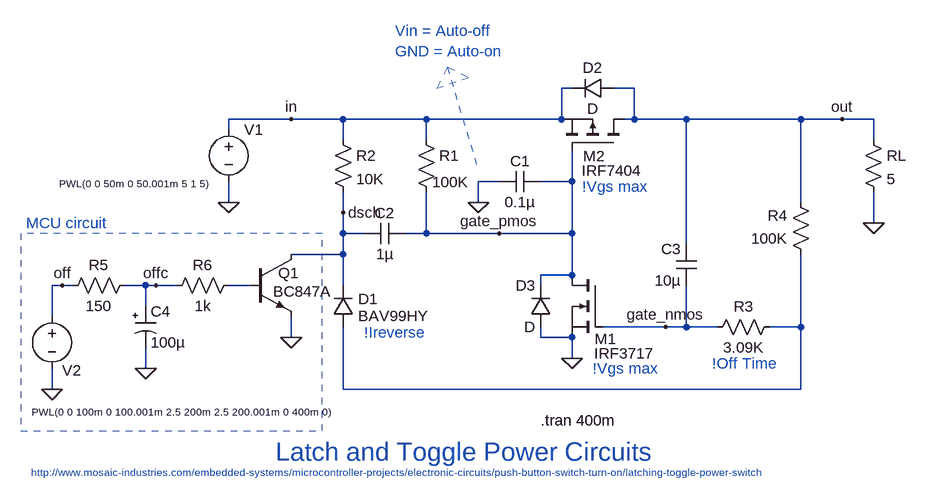
[diagram p0: schematic 01-analog_latch_npmos.asc]
01-analog_latch_npmos.asc, the LTspice schematic file:
Version 4
SHEET 1 1268 680
WIRE 240 -160 224 -160
WIRE 336 -160 304 -160
WIRE -192 -112 -288 -112
WIRE -112 -112 -192 -112
WIRE 16 -112 -112 -112
WIRE 224 -112 224 -160
WIRE 224 -112 16 -112
WIRE 336 -112 336 -160
WIRE 336 -112 320 -112
WIRE 416 -112 336 -112
WIRE 592 -112 416 -112
WIRE 656 -112 592 -112
WIRE 704 -112 656 -112
WIRE -288 -96 -288 -112
WIRE -112 -80 -112 -112
WIRE 16 -80 16 -112
WIRE 704 -80 704 -112
WIRE 128 -16 96 -16
WIRE 240 -16 240 -64
WIRE 240 -16 192 -16
WIRE -288 16 -288 -16
WIRE 96 16 96 -16
WIRE 592 16 592 -112
WIRE -112 32 -112 0
WIRE 704 48 704 0
WIRE -112 64 -112 32
WIRE -80 64 -112 64
WIRE 16 64 16 0
WIRE 16 64 -16 64
WIRE 128 64 16 64
WIRE 240 64 240 -16
WIRE 240 64 128 64
WIRE 416 80 416 -112
WIRE -112 96 -112 64
WIRE -112 96 -192 96
WIRE 240 128 240 64
WIRE 240 128 192 128
WIRE -544 144 -560 144
WIRE -528 144 -544 144
WIRE -416 144 -448 144
WIRE -400 144 -416 144
WIRE -368 144 -400 144
WIRE -256 144 -288 144
WIRE -112 144 -112 96
WIRE 192 144 192 128
WIRE -416 176 -416 144
WIRE -560 192 -560 144
WIRE 384 208 288 208
WIRE 416 208 416 144
WIRE 416 208 384 208
WIRE 464 208 416 208
WIRE 592 208 592 96
WIRE 592 208 544 208
WIRE -192 224 -192 192
WIRE 192 224 192 208
WIRE 240 224 192 224
WIRE 240 256 240 224
WIRE -416 272 -416 240
WIRE -560 304 -560 272
WIRE -112 304 -112 208
WIRE 592 304 592 208
WIRE 592 304 -112 304
FLAG -288 16 0
FLAG 240 256 0
FLAG 704 48 0
FLAG -192 -112 in
FLAG 656 -112 out
FLAG 96 16 0
FLAG -560 304 0
FLAG -192 224 0
FLAG -544 144 off
FLAG 128 64 gate_pmos
FLAG 384 208 gate_nmos
FLAG -112 32 dsch
FLAG -416 272 0
FLAG -400 144 offc
SYMBOL nmos 288 128 M0
WINDOW 0 -21 98 Left 2
WINDOW 3 -79 121 Left 2
SYMATTR InstName M1
SYMATTR Value IRF3717
SYMBOL pmos 320 -64 M270
WINDOW 0 -9 63 VLeft 2
WINDOW 3 -31 65 VLeft 2
SYMATTR InstName M2
SYMATTR Value IRF7404
SYMBOL cap 192 -32 R90
WINDOW 0 0 32 VBottom 2
WINDOW 3 32 32 VTop 2
SYMATTR InstName C1
SYMATTR Value 0.1µ
SYMATTR SpiceLine V=50 Irms=728m Rser=0.14361 Lser=0 mfg="KEMET" pn="C0603C104K5RAC" type="X7R"
SYMBOL res 0 -96 R0
WINDOW 3 25 81 Left 2
SYMATTR InstName R1
SYMATTR Value 100K
SYMATTR SpiceLine tol=1 pwr=0.1
SYMBOL res -128 -96 R0
SYMATTR InstName R2
SYMATTR Value 10K
SYMATTR SpiceLine tol=1 pwr=0.1
SYMBOL cap -16 48 R90
WINDOW 0 0 32 VBottom 2
WINDOW 3 32 32 VTop 2
SYMATTR InstName C2
SYMATTR Value 1µ
SYMATTR SpiceLine V=50 Irms=3.41 Rser=0.0133158 Lser=0 mfg="KEMET" pn="C1206C105K5RAC" type="X7R"
SYMBOL diode -96 208 R180
WINDOW 0 -38 43 Left 2
WINDOW 3 -114 17 Left 2
SYMATTR InstName D1
SYMATTR Value BAV99HY
SYMBOL cap 432 144 R180
WINDOW 0 24 56 Left 2
WINDOW 3 24 8 Left 2
SYMATTR InstName C3
SYMATTR Value 10µ
SYMATTR SpiceLine V=50 Irms=0 Rser=0.003 Lser=1.2n mfg="Würth Elektronik" pn="885012214005 WCAP-CSGP 2220" type="X7R"
SYMBOL res 560 192 R90
WINDOW 0 0 56 VBottom 2
WINDOW 3 32 56 VTop 2
SYMATTR InstName R3
SYMATTR Value 3.09K
SYMATTR SpiceLine tol=1 pwr=0.1
SYMBOL res 608 112 R180
WINDOW 0 36 76 Left 2
WINDOW 3 36 40 Left 2
SYMATTR InstName R4
SYMATTR Value 100K
SYMATTR SpiceLine tol=1 pwr=0.1
SYMBOL voltage -288 -112 R0
WINDOW 3 -261 99 Left 1
WINDOW 123 0 0 Left 0
WINDOW 39 0 0 Left 0
SYMATTR InstName V1
SYMATTR Value PWL(0 0 50m 0 50.001m 5 1 5)
SYMBOL res 688 -96 R0
SYMATTR InstName RL
SYMATTR Value 5
SYMBOL diode 304 -176 R90
WINDOW 0 0 32 VBottom 2
WINDOW 3 32 32 VTop 2
SYMATTR InstName D2
SYMBOL diode 208 208 R180
WINDOW 0 24 64 Left 2
WINDOW 3 24 0 Left 2
SYMATTR InstName D3
SYMBOL voltage -560 176 R0
WINDOW 0 16 99 Left 2
WINDOW 3 -31 163 Left 1
WINDOW 123 0 0 Left 0
WINDOW 39 0 0 Left 0
SYMATTR InstName V2
SYMATTR Value PWL(0 0 100m 0 100.001m 2.5 200m 2.5 200.001m 0 400m 0)
SYMBOL npn -256 96 R0
WINDOW 0 44 29 Left 2
WINDOW 3 36 57 Left 2
SYMATTR InstName Q1
SYMATTR Value BC847A
SYMBOL res -432 128 R90
WINDOW 0 0 56 VBottom 2
WINDOW 3 32 56 VTop 2
SYMATTR InstName R5
SYMATTR Value 150
SYMATTR SpiceLine tol=1 pwr=0.1
SYMBOL polcap -432 176 R0
WINDOW 3 24 56 Left 2
SYMATTR InstName C4
SYMATTR Value 100µ
SYMATTR Description Capacitor
SYMATTR Type cap
SYMATTR SpiceLine V=10 Irms=0 Rser=0.1 Lser=0 mfg="AVX" pn="TPSD107M010R0100" type="Tantalum"
SYMBOL res -272 128 R90
WINDOW 0 0 56 VBottom 2
WINDOW 3 32 56 VTop 2
SYMATTR InstName R6
SYMATTR Value 1k
SYMATTR SpiceLine tol=1 pwr=0.1
TEXT 192 352 Left 2 !.tran 400m
TEXT -592 432 Left 1 ;http://www.mosaic-industries.com/embedded-systems/microcontroller-projects/electronic-circuits/push-button-switch-turn-on/latching-toggle-power-switch
TEXT -216 400 Left 4 ;Latch and Toggle Power Circuits
TEXT -600 48 Left 2 ;MCU circuit
TEXT -32 -248 Left 2 ;Vin = Auto-off\nGND = Auto-on
TEXT 256 -8 Left 2 ;!Vgs max
TEXT 272 272 Left 2 ;!Vgs max
TEXT 456 264 Left 2 ;!Off Time
TEXT -80 216 Left 2 ;!Ireverse
LINE Normal 48 -192 96 -32 2
LINE Normal 80 -176 48 -192 2
LINE Normal 32 -160 80 -176 2
LINE Normal 48 -192 32 -160 2
RECTANGLE Normal -608 368 -144 64 2

The netlist it stands for:
* 01-analog_latch_npmos.asc
M1 gate_pmos gate_nmos 0 0 IRF3717
M2 out gate_pmos in in IRF7404
C1 gate_pmos 0 0.1µ V=50 Irms=728m Rser=0.14361 Lser=0 mfg="KEMET" pn="C0603C104K5RAC" type="X7R"
R1 in gate_pmos 100K tol=1 pwr=0.1
R2 in dsch 10K tol=1 pwr=0.1
C2 gate_pmos dsch 1µ V=50 Irms=3.41 Rser=0.0133158 Lser=0 mfg="KEMET" pn="C1206C105K5RAC" type="X7R"
D1 N002 dsch BAV99HY
C3 gate_nmos out 10µ V=50 Irms=0 Rser=0.003 Lser=1.2n mfg="Würth Elektronik" pn="885012214005 WCAP-CSGP 2220" type="X7R"
R3 N002 gate_nmos 3.09K tol=1 pwr=0.1
R4 N002 out 100K tol=1 pwr=0.1
V1 in 0 PWL(0 0 50m 0 50.001m 5 1 5)
RL out 0 5
D2 out in D
D3 0 gate_pmos D
V2 off 0 PWL(0 0 100m 0 100.001m 2.5 200m 2.5 200.001m 0 400m 0)
Q1 dsch N001 0 0 BC847A
R5 offc off 150 tol=1 pwr=0.1
C4 offc 0 100µ V=10 Irms=0 Rser=0.1 Lser=0 mfg="AVX" pn="TPSD107M010R0100" type="Tantalum"
R6 N001 offc 1k tol=1 pwr=0.1
.model D D
.lib standard.dio
.model NPN NPN
.model PNP PNP
.lib standard.bjt
.model NMOS NMOS
.model PMOS PMOS
.lib standard.mos
.tran 400m
* http://www.mosaic-industries.com/embedded-systems/microcontroller-projects/electronic-circuits/push-button-switch-turn-on/latching-toggle-power-switch
* Latch and Toggle Power Circuits
* MCU circuit
* Vin = Auto-off
* GND = Auto-on
* !Vgs max
* !Vgs max
* !Off Time
* !Ireverse
.backanno
.end

* Results of the author's LTspice run, read from the files saved beside the schematic
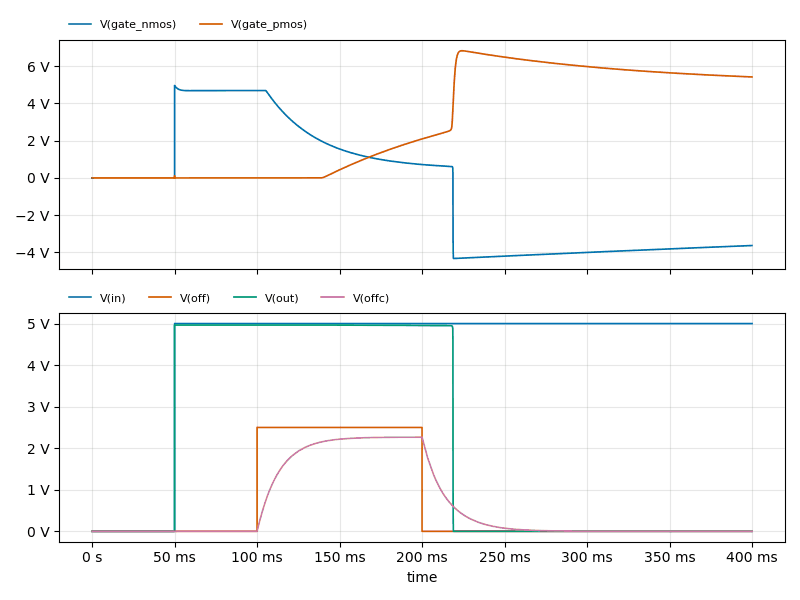
[diagram p1: Transient Analysis of 01-analog_latch_npmos.asc, plotted from the saved traces]
* Transient Analysis, 1 run:
*   V(gate_nmos): min -4.326 V, max 4.963 V, average -677.3 mV, rms 3.364 V, last -3.63 V
*   V(gate_pmos): min -56.66 µV, max 6.831 V, average 2.989 V, rms 4.095 V, last 5.424 V
*   V(in): min 0 V, max 5 V, average 4.375 V, rms 4.677 V, last 5 V
*   V(off): min 0 V, max 2.5 V, average 625 mV, rms 1.25 V, last 0 V
*   V(out): min 0 V, max 4.964 V, average 2.093 V, rms 3.222 V, last 0 V
*   V(offc): min -687.7 nV, max 2.267 V, average 573.6 mV, rms 1.06 V, last 3.449 µV